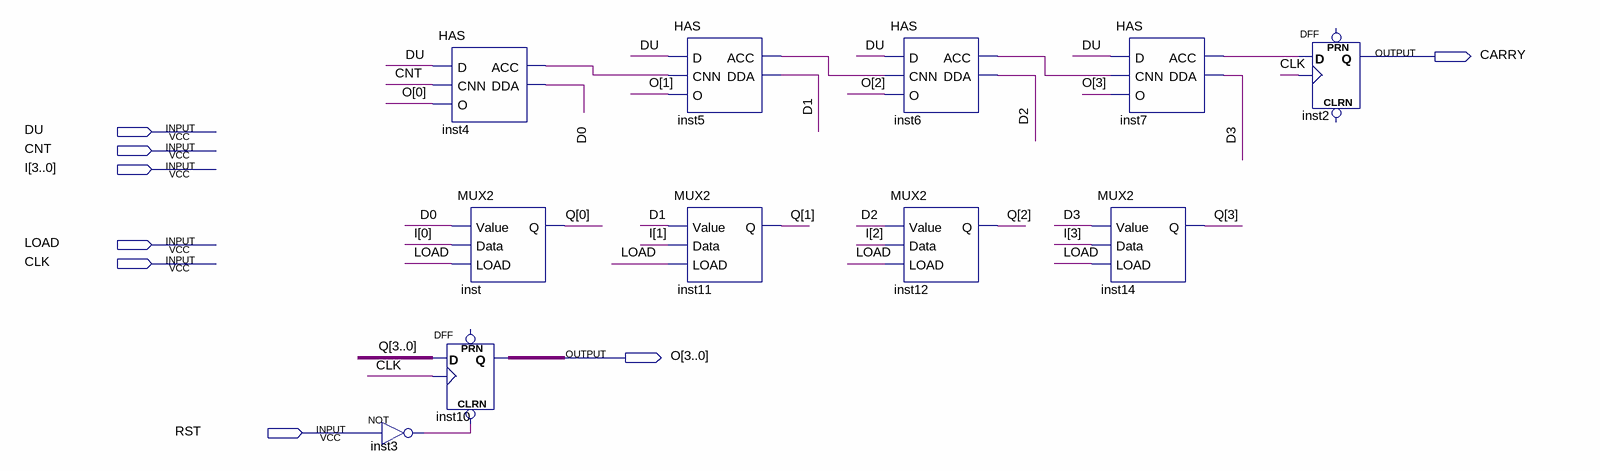
[diagram p0: schematic sheet]
// Quartus schematic 4BITupdown.bdf as structural Verilog: 11 symbols, 8 pins
module \4BITupdown  (
  input  DU,
  input  CNT,
  input  [3:0] I,
  input  LOAD,
  input  CLK,
  input  RST,
  output CARRY,
  output [3:0] O
);

  wire D0, D1, D2, D3, inst3_out, inst4_acc, inst5_acc, inst6_acc, inst7_acc;
  wire [3:0] Q;

  not inst3 (inst3_out, RST);
  HAS inst4 (.D(DU), .CNN(CNT), .O(O[0]), .ACC(inst4_acc), .DDA(D0));
  MUX2 inst (.Value(D0), .Data(I[0]), .LOAD(LOAD), .Q(Q[0]));
  DFF inst10[3:0] (.CLRN(inst3_out), .CLK(CLK), .D(Q), .Q(O));  // open: PRN
  HAS inst5 (.D(DU), .CNN(inst4_acc), .O(O[1]), .ACC(inst5_acc), .DDA(D1));
  MUX2 inst11 (.Value(D1), .Data(I[1]), .LOAD(LOAD), .Q(Q[1]));
  HAS inst6 (.D(DU), .CNN(inst5_acc), .O(O[2]), .ACC(inst6_acc), .DDA(D2));
  MUX2 inst12 (.Value(D2), .Data(I[2]), .LOAD(LOAD), .Q(Q[2]));
  HAS inst7 (.D(DU), .CNN(inst6_acc), .O(O[3]), .ACC(inst7_acc), .DDA(D3));
  MUX2 inst14 (.Value(D3), .Data(I[3]), .LOAD(LOAD), .Q(Q[3]));
  DFF inst2 (.CLK(CLK), .D(inst7_acc), .Q(CARRY));  // open: CLRN, PRN
endmodule
